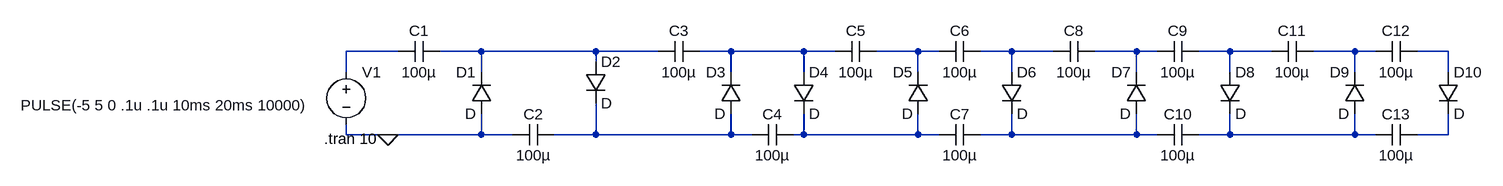
[diagram p0: schematic Walton Multplier.asc]
Walton Multplier.asc, the LTspice schematic file:
Version 4
SHEET 1 1688 680
WIRE 16 80 -64 80
WIRE 144 80 80 80
WIRE 320 80 144 80
WIRE 416 80 320 80
WIRE 528 80 480 80
WIRE 640 80 528 80
WIRE 688 80 640 80
WIRE 816 80 752 80
WIRE 848 80 816 80
WIRE 960 80 912 80
WIRE 1024 80 960 80
WIRE 1152 80 1088 80
WIRE 1184 80 1152 80
WIRE 1296 80 1248 80
WIRE 1360 80 1296 80
WIRE 1488 80 1424 80
WIRE 1520 80 1488 80
WIRE 1632 80 1584 80
WIRE 320 96 320 80
WIRE -64 112 -64 80
WIRE 144 112 144 80
WIRE 528 112 528 80
WIRE 640 112 640 80
WIRE 816 112 816 80
WIRE 960 112 960 80
WIRE 1152 112 1152 80
WIRE 1296 112 1296 80
WIRE 1488 112 1488 80
WIRE 1632 112 1632 80
WIRE -64 208 -64 192
WIRE 0 208 -64 208
WIRE 144 208 144 176
WIRE 144 208 0 208
WIRE 192 208 144 208
WIRE 320 208 320 160
WIRE 320 208 256 208
WIRE 528 208 528 176
WIRE 528 208 320 208
WIRE 560 208 528 208
WIRE 640 208 640 176
WIRE 640 208 624 208
WIRE 816 208 816 176
WIRE 816 208 640 208
WIRE 848 208 816 208
WIRE 960 208 960 176
WIRE 960 208 912 208
WIRE 1152 208 1152 176
WIRE 1152 208 960 208
WIRE 1184 208 1152 208
WIRE 1296 208 1296 176
WIRE 1296 208 1248 208
WIRE 1488 208 1488 176
WIRE 1488 208 1296 208
WIRE 1520 208 1488 208
WIRE 1632 208 1632 176
WIRE 1632 208 1584 208
FLAG 0 208 0
SYMBOL voltage -64 96 R0
WINDOW 3 -501 67 Left 2
WINDOW 123 0 0 Left 0
WINDOW 39 0 0 Left 0
SYMATTR InstName V1
SYMATTR Value PULSE(-5 5 0 .1u .1u 10ms 20ms 10000)
SYMBOL cap 80 64 R90
WINDOW 0 0 32 VBottom 2
WINDOW 3 32 32 VTop 2
SYMATTR InstName C1
SYMATTR Value 100µ
SYMBOL diode 160 176 R180
WINDOW 0 24 64 Left 2
WINDOW 3 24 0 Left 2
SYMATTR InstName D1
SYMBOL diode 304 96 R0
SYMATTR InstName D2
SYMBOL cap 256 192 R90
WINDOW 0 0 32 VBottom 2
WINDOW 3 32 32 VTop 2
SYMATTR InstName C2
SYMATTR Value 100µ
SYMBOL cap 480 64 R90
WINDOW 0 0 32 VBottom 2
WINDOW 3 32 32 VTop 2
SYMATTR InstName C3
SYMATTR Value 100µ
SYMBOL cap 624 192 R90
WINDOW 0 0 32 VBottom 2
WINDOW 3 32 32 VTop 2
SYMATTR InstName C4
SYMATTR Value 100µ
SYMBOL cap 752 64 R90
WINDOW 0 0 32 VBottom 2
WINDOW 3 32 32 VTop 2
SYMATTR InstName C5
SYMATTR Value 100µ
SYMBOL diode 544 176 R180
WINDOW 0 24 64 Left 2
WINDOW 3 24 0 Left 2
SYMATTR InstName D3
SYMBOL diode 624 112 R0
SYMATTR InstName D4
SYMBOL diode 832 176 R180
WINDOW 0 24 64 Left 2
WINDOW 3 24 0 Left 2
SYMATTR InstName D5
SYMBOL cap 912 64 R90
WINDOW 0 0 32 VBottom 2
WINDOW 3 32 32 VTop 2
SYMATTR InstName C6
SYMATTR Value 100µ
SYMBOL diode 944 112 R0
SYMATTR InstName D6
SYMBOL cap 912 192 R90
WINDOW 0 0 32 VBottom 2
WINDOW 3 32 32 VTop 2
SYMATTR InstName C7
SYMATTR Value 100µ
SYMBOL cap 1088 64 R90
WINDOW 0 0 32 VBottom 2
WINDOW 3 32 32 VTop 2
SYMATTR InstName C8
SYMATTR Value 100µ
SYMBOL diode 1168 176 R180
WINDOW 0 24 64 Left 2
WINDOW 3 24 0 Left 2
SYMATTR InstName D7
SYMBOL cap 1248 64 R90
WINDOW 0 0 32 VBottom 2
WINDOW 3 32 32 VTop 2
SYMATTR InstName C9
SYMATTR Value 100µ
SYMBOL diode 1280 112 R0
SYMATTR InstName D8
SYMBOL cap 1248 192 R90
WINDOW 0 0 32 VBottom 2
WINDOW 3 32 32 VTop 2
SYMATTR InstName C10
SYMATTR Value 100µ
SYMBOL cap 1424 64 R90
WINDOW 0 0 32 VBottom 2
WINDOW 3 32 32 VTop 2
SYMATTR InstName C11
SYMATTR Value 100µ
SYMBOL diode 1504 176 R180
WINDOW 0 24 64 Left 2
WINDOW 3 24 0 Left 2
SYMATTR InstName D9
SYMBOL cap 1584 64 R90
WINDOW 0 0 32 VBottom 2
WINDOW 3 32 32 VTop 2
SYMATTR InstName C12
SYMATTR Value 100µ
SYMBOL diode 1616 112 R0
SYMATTR InstName D10
SYMBOL cap 1584 192 R90
WINDOW 0 0 32 VBottom 2
WINDOW 3 32 32 VTop 2
SYMATTR InstName C13
SYMATTR Value 100µ
TEXT -98 214 Left 2 !.tran 10

The netlist it stands for:
* Walton Multplier.asc
V1 N001 0 PULSE(-5 5 0 .1u .1u 10ms 20ms 10000)
C1 N002 N001 100µ
D1 0 N002 D
D2 N002 N010 D
C2 N010 0 100µ
C3 N003 N002 100µ
C4 N011 N010 100µ
C5 N004 N003 100µ
D3 N010 N003 D
D4 N003 N011 D
D5 N011 N004 D
C6 N005 N004 100µ
D6 N005 N012 D
C7 N012 N011 100µ
C8 N006 N005 100µ
D7 N012 N006 D
C9 N007 N006 100µ
D8 N007 N013 D
C10 N013 N012 100µ
C11 N008 N007 100µ
D9 N013 N008 D
C12 N009 N008 100µ
D10 N009 N014 D
C13 N014 N013 100µ
.model D D
.lib standard.dio
.tran 10
.backanno
.end